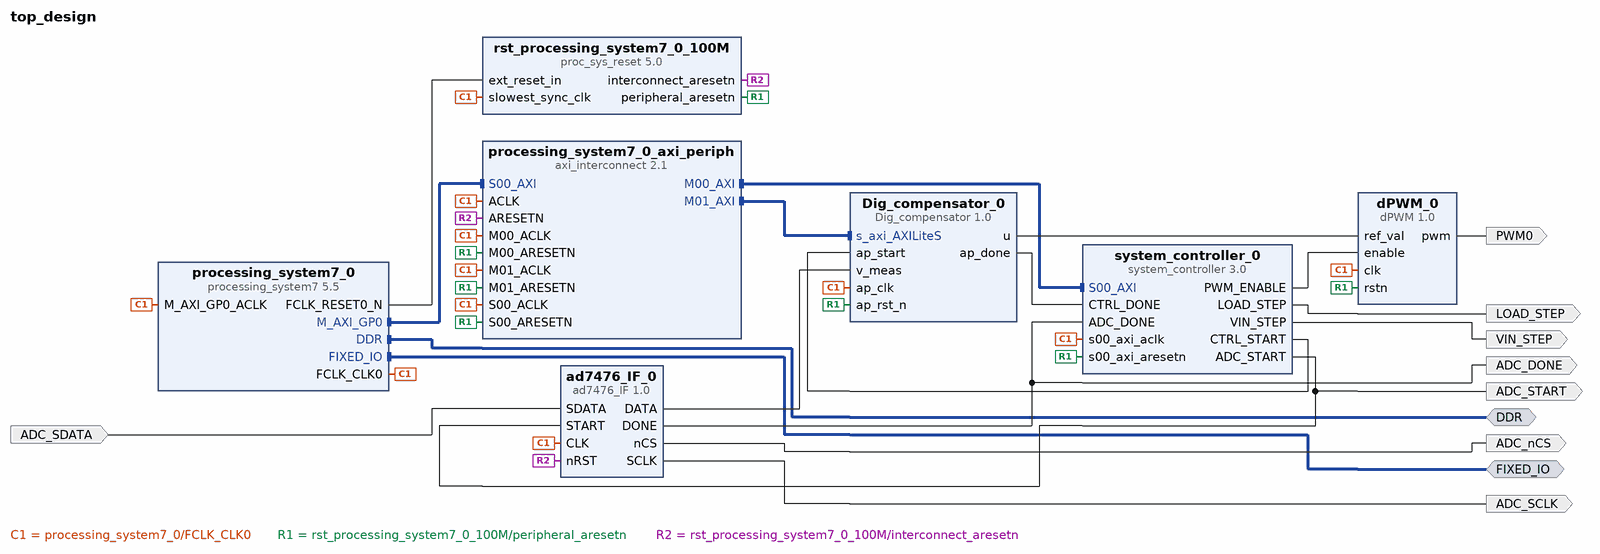
[diagram p0: block diagram of the top level]
# Vivado block design top_design, Vivado 2016.1
create_bd_design top_design

create_bd_intf_port -mode Master -vlnv xilinx.com:interface:ddrx_rtl:1.0 DDR
create_bd_intf_port -mode Master -vlnv xilinx.com:display_processing_system7:fixedio_rtl:1.0 FIXED_IO
create_bd_port -dir O PWM0
create_bd_port -dir O ADC_nCS
create_bd_port -dir O ADC_SCLK
create_bd_port -dir I ADC_SDATA
create_bd_port -dir O ADC_DONE
create_bd_port -dir O ADC_START
create_bd_port -dir O VIN_STEP
create_bd_port -dir O LOAD_STEP

create_bd_cell -type ip -vlnv xilinx.com:ip:processing_system7:5.5 processing_system7_0
set_property -dict [list \
  CONFIG.PCW_UIPARAM_DDR_FREQ_MHZ 525 \
  CONFIG.PCW_CRYSTAL_PERIPHERAL_FREQMHZ 50.000000 \
  CONFIG.PCW_APU_PERIPHERAL_FREQMHZ 650 \
  CONFIG.PCW_SDIO_PERIPHERAL_FREQMHZ 50 \
  CONFIG.PCW_FPGA0_PERIPHERAL_FREQMHZ 100 \
  CONFIG.PCW_IMPORT_BOARD_PRESET C:/Users/Gonzalo/Downloads/ZYBO_zynq_def.xml \
  CONFIG.PCW_PRESET_BANK1_VOLTAGE {LVCMOS 1.8V} \
  CONFIG.PCW_UIPARAM_DDR_PARTNO {MT41K128M16 JT-125} \
  CONFIG.PCW_QSPI_PERIPHERAL_ENABLE 1 \
  CONFIG.PCW_QSPI_GRP_SINGLE_SS_ENABLE 1 \
  CONFIG.PCW_QSPI_GRP_FBCLK_ENABLE 1 \
  CONFIG.PCW_ENET0_PERIPHERAL_ENABLE 1 \
  CONFIG.PCW_ENET0_ENET0_IO {MIO 16 .. 27} \
  CONFIG.PCW_ENET0_GRP_MDIO_ENABLE 1 \
  CONFIG.PCW_SD0_PERIPHERAL_ENABLE 1 \
  CONFIG.PCW_SD0_GRP_CD_ENABLE 1 \
  CONFIG.PCW_SD0_GRP_CD_IO {MIO 47} \
  CONFIG.PCW_SD0_GRP_WP_ENABLE 1 \
  CONFIG.PCW_UART1_PERIPHERAL_ENABLE 1 \
  CONFIG.PCW_TTC0_PERIPHERAL_ENABLE 1 \
  CONFIG.PCW_USB0_PERIPHERAL_ENABLE 1 \
  CONFIG.PCW_GPIO_MIO_GPIO_ENABLE 1 \
] [get_bd_cells processing_system7_0]
# 105 more settings of processing_system7_0 are not shown: defaults, MIO pin electricals, DDR timing, and values the tool derives
create_bd_cell -type ip -vlnv xilinx.com:ip:axi_interconnect:2.1 processing_system7_0_axi_periph
set_property -dict {CONFIG.NUM_MI 2} [get_bd_cells processing_system7_0_axi_periph]
create_bd_cell -type ip -vlnv xilinx.com:ip:proc_sys_reset:5.0 rst_processing_system7_0_100M
create_bd_cell -type ip -vlnv gfb:flyback:dPWM:1.0 dPWM_0
create_bd_cell -type ip -vlnv gfb:flyback:Dig_compensator:1.0 Dig_compensator_0
create_bd_cell -type ip -vlnv UC3M:user:system_controller:3.0 system_controller_0
create_bd_cell -type ip -vlnv gfb:ip_cores:ad7476_IF:1.0 ad7476_IF_0

# ---- connections ----

connect_bd_intf_net [get_bd_intf_pins processing_system7_0/M_AXI_GP0] [get_bd_intf_pins processing_system7_0_axi_periph/S00_AXI]
connect_bd_intf_net [get_bd_intf_pins processing_system7_0_axi_periph/M01_AXI] [get_bd_intf_pins Dig_compensator_0/s_axi_AXILiteS]
connect_bd_intf_net [get_bd_intf_pins processing_system7_0_axi_periph/M00_AXI] [get_bd_intf_pins system_controller_0/S00_AXI]
connect_bd_intf_net [get_bd_intf_ports DDR] [get_bd_intf_pins processing_system7_0/DDR]
connect_bd_intf_net [get_bd_intf_ports FIXED_IO] [get_bd_intf_pins processing_system7_0/FIXED_IO]
connect_bd_net [get_bd_pins processing_system7_0/FCLK_CLK0] \
  [get_bd_pins processing_system7_0/M_AXI_GP0_ACLK] [get_bd_pins rst_processing_system7_0_100M/slowest_sync_clk] \
  [get_bd_pins dPWM_0/clk] [get_bd_pins Dig_compensator_0/ap_clk] [get_bd_pins system_controller_0/s00_axi_aclk] \
  [get_bd_pins ad7476_IF_0/CLK] [get_bd_pins processing_system7_0_axi_periph/S00_ACLK] \
  [get_bd_pins processing_system7_0_axi_periph/ACLK] [get_bd_pins processing_system7_0_axi_periph/M00_ACLK] \
  [get_bd_pins processing_system7_0_axi_periph/M01_ACLK]
connect_bd_net [get_bd_pins processing_system7_0/FCLK_RESET0_N] [get_bd_pins rst_processing_system7_0_100M/ext_reset_in]
connect_bd_net [get_bd_pins rst_processing_system7_0_100M/peripheral_aresetn] \
  [get_bd_pins dPWM_0/rstn] [get_bd_pins Dig_compensator_0/ap_rst_n] [get_bd_pins system_controller_0/s00_axi_aresetn] \
  [get_bd_pins processing_system7_0_axi_periph/S00_ARESETN] [get_bd_pins processing_system7_0_axi_periph/M00_ARESETN] \
  [get_bd_pins processing_system7_0_axi_periph/M01_ARESETN]
connect_bd_net [get_bd_pins rst_processing_system7_0_100M/interconnect_aresetn] \
  [get_bd_pins ad7476_IF_0/nRST] [get_bd_pins processing_system7_0_axi_periph/ARESETN]
connect_bd_net [get_bd_pins dPWM_0/pwm] [get_bd_ports PWM0]
connect_bd_net [get_bd_pins ad7476_IF_0/nCS] [get_bd_ports ADC_nCS]
connect_bd_net [get_bd_pins ad7476_IF_0/SCLK] [get_bd_ports ADC_SCLK]
connect_bd_net -net SDATA_1 [get_bd_ports ADC_SDATA] [get_bd_pins ad7476_IF_0/SDATA]
connect_bd_net [get_bd_pins ad7476_IF_0/DATA] [get_bd_pins Dig_compensator_0/v_meas]
connect_bd_net [get_bd_pins Dig_compensator_0/u] [get_bd_pins dPWM_0/ref_val]
connect_bd_net [get_bd_pins ad7476_IF_0/DONE] [get_bd_ports ADC_DONE] [get_bd_pins system_controller_0/ADC_DONE]
connect_bd_net [get_bd_pins system_controller_0/ADC_START] [get_bd_ports ADC_START] [get_bd_pins ad7476_IF_0/START]
connect_bd_net [get_bd_pins system_controller_0/CTRL_START] [get_bd_pins Dig_compensator_0/ap_start]
connect_bd_net [get_bd_pins Dig_compensator_0/ap_done] [get_bd_pins system_controller_0/CTRL_DONE]
connect_bd_net [get_bd_pins system_controller_0/PWM_ENABLE] [get_bd_pins dPWM_0/enable]
connect_bd_net [get_bd_pins system_controller_0/VIN_STEP] [get_bd_ports VIN_STEP]
connect_bd_net [get_bd_pins system_controller_0/LOAD_STEP] [get_bd_ports LOAD_STEP]

# ---- address map ----
assign_bd_address -offset 0x43C00000 -range 64K -target_address_space [get_bd_addr_spaces processing_system7_0/Data] [get_bd_addr_segs system_controller_0/S00_AXI/S00_AXI_reg]
assign_bd_address -offset 0x43C10000 -range 64K -target_address_space [get_bd_addr_spaces processing_system7_0/Data] [get_bd_addr_segs Dig_compensator_0/s_axi_AXILiteS/Reg]

validate_bd_design
save_bd_design
